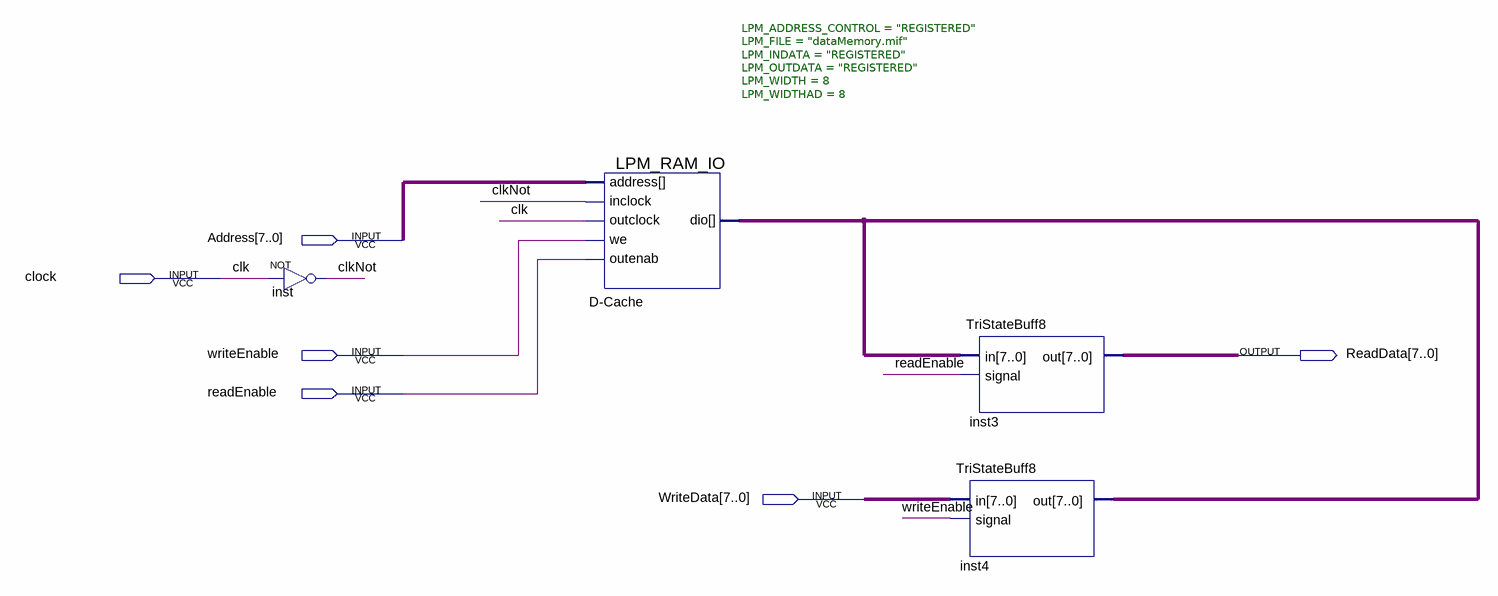
[diagram p0: schematic sheet]
// Quartus schematic DCache.bdf as structural Verilog: 4 symbols, 6 pins
module DCache (
  input  [7:0] Address,
  input  clock,
  input  writeEnable,
  input  readEnable,
  input  [7:0] WriteData,
  output [7:0] ReadData
);

  wire clkNot;
  wire [7:0] D_Cache_dio;

  not inst (clkNot, clock);
  LPM_RAM_IO #(.LPM_ADDRESS_CONTROL("REGISTERED"), .LPM_FILE("dataMemory.mif"), .LPM_INDATA("REGISTERED"), .LPM_OUTDATA("REGISTERED"), .LPM_WIDTH(8), .LPM_WIDTHAD(8)) \D-Cache  (
    .address(Address), .inclock(clkNot), .outclock(clock), .outenab(readEnable), .we(writeEnable),
    .dio(D_Cache_dio));
  TriStateBuff8 inst3 (.in(D_Cache_dio), .signal(readEnable), .out(ReadData));
  TriStateBuff8 inst4 (.in(WriteData), .signal(writeEnable), .out(D_Cache_dio));

  // Other names for the same wires on the sheet: clk = clock
endmodule
